# Altium schematic sheet 1-Pic.SchDoc
size A4
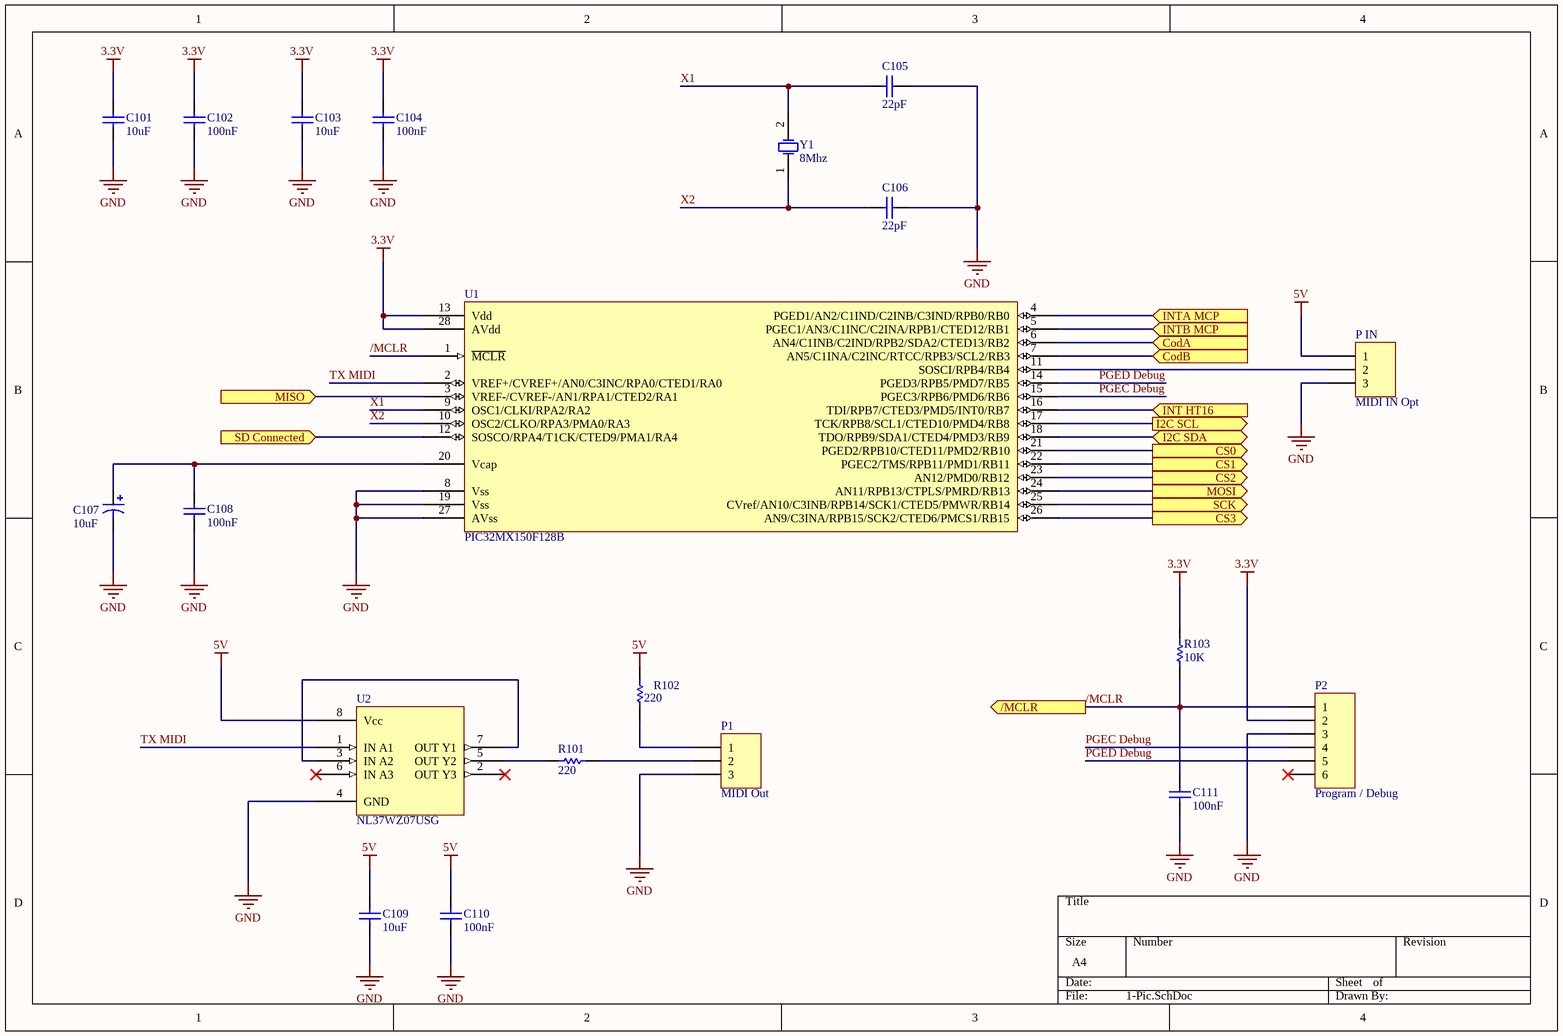
[diagram p0: 1-Pic.SchDoc]

## Parts
C101  10uF  [capa 1206]
C102  100nF  [capa 1206]
C103  10uF  [capa 1206]
C104  100nF  [capa 1206]
C105  22pF  [capa 1206]
C106  22pF  [capa 1206]
C107  10uF  [CAPA 1206 POL]
C108  100nF  [capa 1206]
C109  10uF  [capa 1206]
C110  100nF  [capa 1206]
C111  100nF  [capa 1206]
P1  MIDI Out  [MIDI]
P2  Program / Debug  [HDR1X6]
P_IN  MIDI IN Opt  [MIDI]
R101  220  [RES 1206]
R102  220  [RES 1206]
R103  10K  [RES 1206]
U1  PIC32MX150F128B  [PIC32MX150F128B-I/SO]
U2  NL37WZ07USG  [NL37WZ07USG]
Y1  8Mhz  [HC49/4H SMX CRYSTAL]

## Ports
/MCLR (out), CodA (in), CodB (in), CS0 (out), CS1 (out), CS2 (out), CS3 (out), I2C SCL (out), I2C SDA, INT HT16 (in), INTA MCP (in), INTB MCP (in), MISO (in), MOSI (out), SCK (out), SD Connected (in)

## Nets
3.3V: C101.1 C102.1 C103.1 C104.1 P2.2 R103.2 U1.13(Vdd) U1.28(AVdd)
5V: C109.1 C110.1 P_IN.1 R102.2 U2.8(Vcc)
GND: C101.2 C102.2 C103.2 C104.2 C105.2 C106.2 C107.2 C108.2 C109.2 C110.2 C111.1 P1.3 P2.3 P_IN.3 U1.8(Vss) U1.19(Vss) U1.27(AVss) U2.4(GND)
/MCLR: C111.2 P2.1 R103.1 U1.1(~{MCLR}) ; port /MCLR
CodA: U1.6(AN4/C1INB/C2IND/RPB2/SDA2/CTED13/RB2) ; port CodA
CodB: U1.7(AN5/C1INA/C2INC/RTCC/RPB3/SCL2/RB3) ; port CodB
CS0: U1.21(PGED2/RPB10/CTED11/PMD2/RB10) ; port CS0
CS1: U1.22(PGEC2/TMS/RPB11/PMD1/RB11) ; port CS1
CS2: U1.23(AN12/PMD0/RB12) ; port CS2
CS3: U1.26(AN9/C3INA/RPB15/SCK2/CTED6/PMCS1/RB15) ; port CS3
I2C SCL: U1.17(TCK/RPB8/SCL1/CTED10/PMD4/RB8) ; port I2C SCL
I2C SDA: U1.18(TDO/RPB9/SDA1/CTED4/PMD3/RB9) ; port I2C SDA
INT HT16: U1.16(TDI/RPB7/CTED3/PMD5/INT0/RB7) ; port INT HT16
INTA MCP: U1.4(PGED1/AN2/C1IND/C2INB/C3IND/RPB0/RB0) ; port INTA MCP
INTB MCP: U1.5(PGEC1/AN3/C1INC/C2INA/RPB1/CTED12/RB1) ; port INTB MCP
MISO: U1.3(VREF-/CVREF-/AN1/RPA1/CTED2/RA1) ; port MISO
MOSI: U1.24(AN11/RPB13/CTPLS/PMRD/RB13) ; port MOSI
PGEC Debug: P2.4 U1.15(PGEC3/RPB6/PMD6/RB6)
PGED Debug: P2.5 U1.14(PGED3/RPB5/PMD7/RB5)
SCK: U1.25(CVref/AN10/C3INB/RPB14/SCK1/CTED5/PMWR/RB14) ; port SCK
SD Connected: U1.12(SOSCO/RPA4/T1CK/CTED9/PMA1/RA4) ; port SD Connected
TX MIDI: U1.2(VREF+/CVREF+/AN0/C3INC/RPA0/CTED1/RA0) U2.1(IN_A1)
X1: C105.1 U1.9(OSC1/CLKI/RPA2/RA2) Y1.2(OSC2)
X2: C106.1 U1.10(OSC2/CLKO/RPA3/PMA0/RA3) Y1.1(OSC1)
NetC107_1: C107.1 C108.1 U1.20(Vcap)
NetP1_1: P1.1 R102.1
NetP1_2: P1.2 R101.1
NetP_IN_2: P_IN.2 U1.11(SOSCI/RPB4/RB4)
NetR101_2: R101.2 U2.5(OUT_Y2)
NetU2_3: U2.3(IN_A2) U2.7(OUT_Y1)

Not connected (* = marked no-connect by the designer): P2 6*; U2 2(OUT_Y3)* 6(IN_A3)*

## Library data of the parts
C101 C103 C109 = Cap: Capacitor; Fabricant: MULTICOMP; Fournisseur: Farnell; RefFabricant: MC1206X106K160CT; RefFournisseur: 2320922
C102 C104 C108 C110 C111 = Cap: Capacitor; Fabricant: MULTICOMP; Fournisseur: Farnell; RefFabricant: MC1206B104K500CT; RefFournisseur: 1759361
C105 C106 = Cap: Capacitor; Fabricant: MULTICOMP; Fournisseur: Farnell; RefFabricant: MC1206N220J101CT; RefFournisseur: 2320864
C107 = Cap Pol1: Polarized Capacitor (Radial); Fabricant: KEMET; Fournisseur: Farnell; RefFabricant: T491A106K010AT; RefFournisseur: 1457413
P1 P_IN = Header 3: Header, 3-Pin; Fabricant: N/A; Fournisseur: N/A; RefFabricant: N/A; RefFournisseur: N/A
P2 = Header 6: Header, 6-Pin; Fabricant: N/A; Fournisseur: N/A; RefFabricant: N/A; RefFournisseur: N/A
R101 R102 = Res1: Resistor; Fabricant: MULTICOMP; Fournisseur: Farnell; RefFabricant: MC0125W12065220R; RefFournisseur: 9337210
R103 = Res1: Resistor; Fabricant: MULTICOMP; Fournisseur: Farmell; RefFabricant: MC0125W1206510K; RefFournisseur: 9337016
U1 = PIC32MX150F128B: Fabricant: Microchip; Fournisseur: Farnell; RefFournisseur: 2313766; RefFabricant: PIC32MX150F128B-I/SO
U2 = NL37WZ07USG: Fabricant: ON SEMICONDUCTOR; Fournisseur: Farnell; RefFournisseur: 2534491; RefFabricant: NL37WZ07USG
Y1 = XTAL: Crystal Oscillator; Fabricant: FOX ELECTRONICS; Fournisseur: Farnell; RefFabricant: FOXSDLF/080-20; RefFournisseur: 2063972